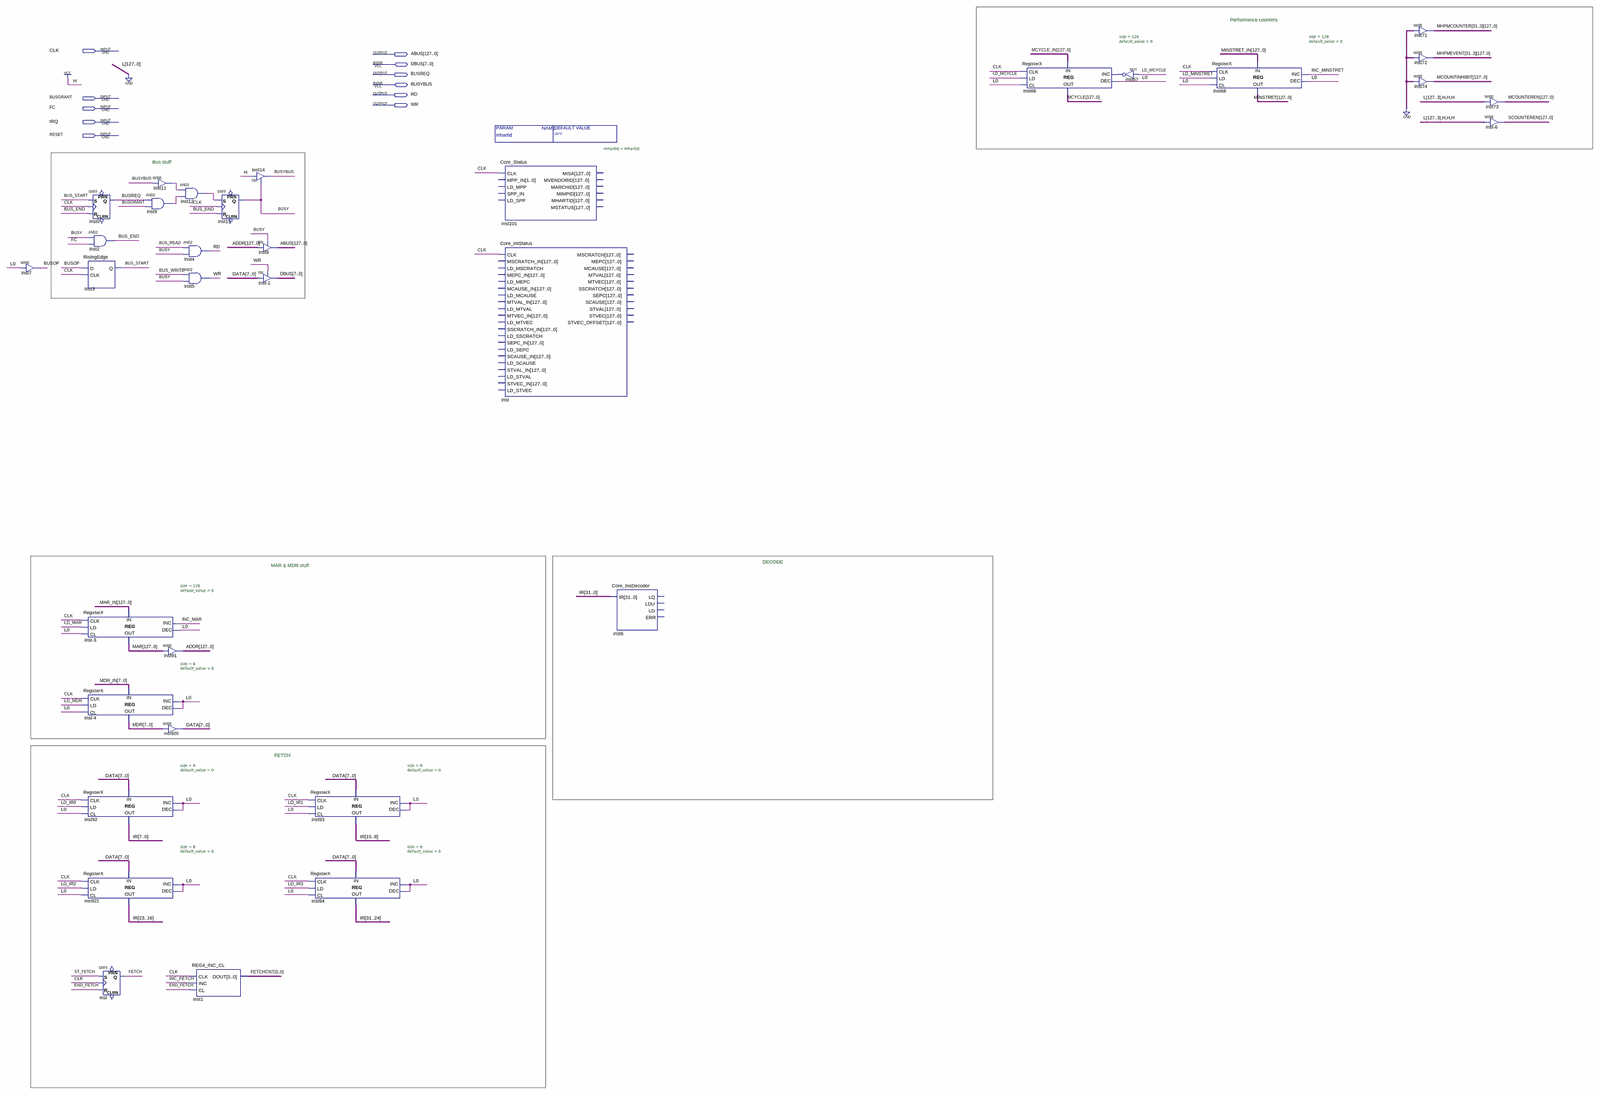
[diagram p0: schematic sheet, whole]
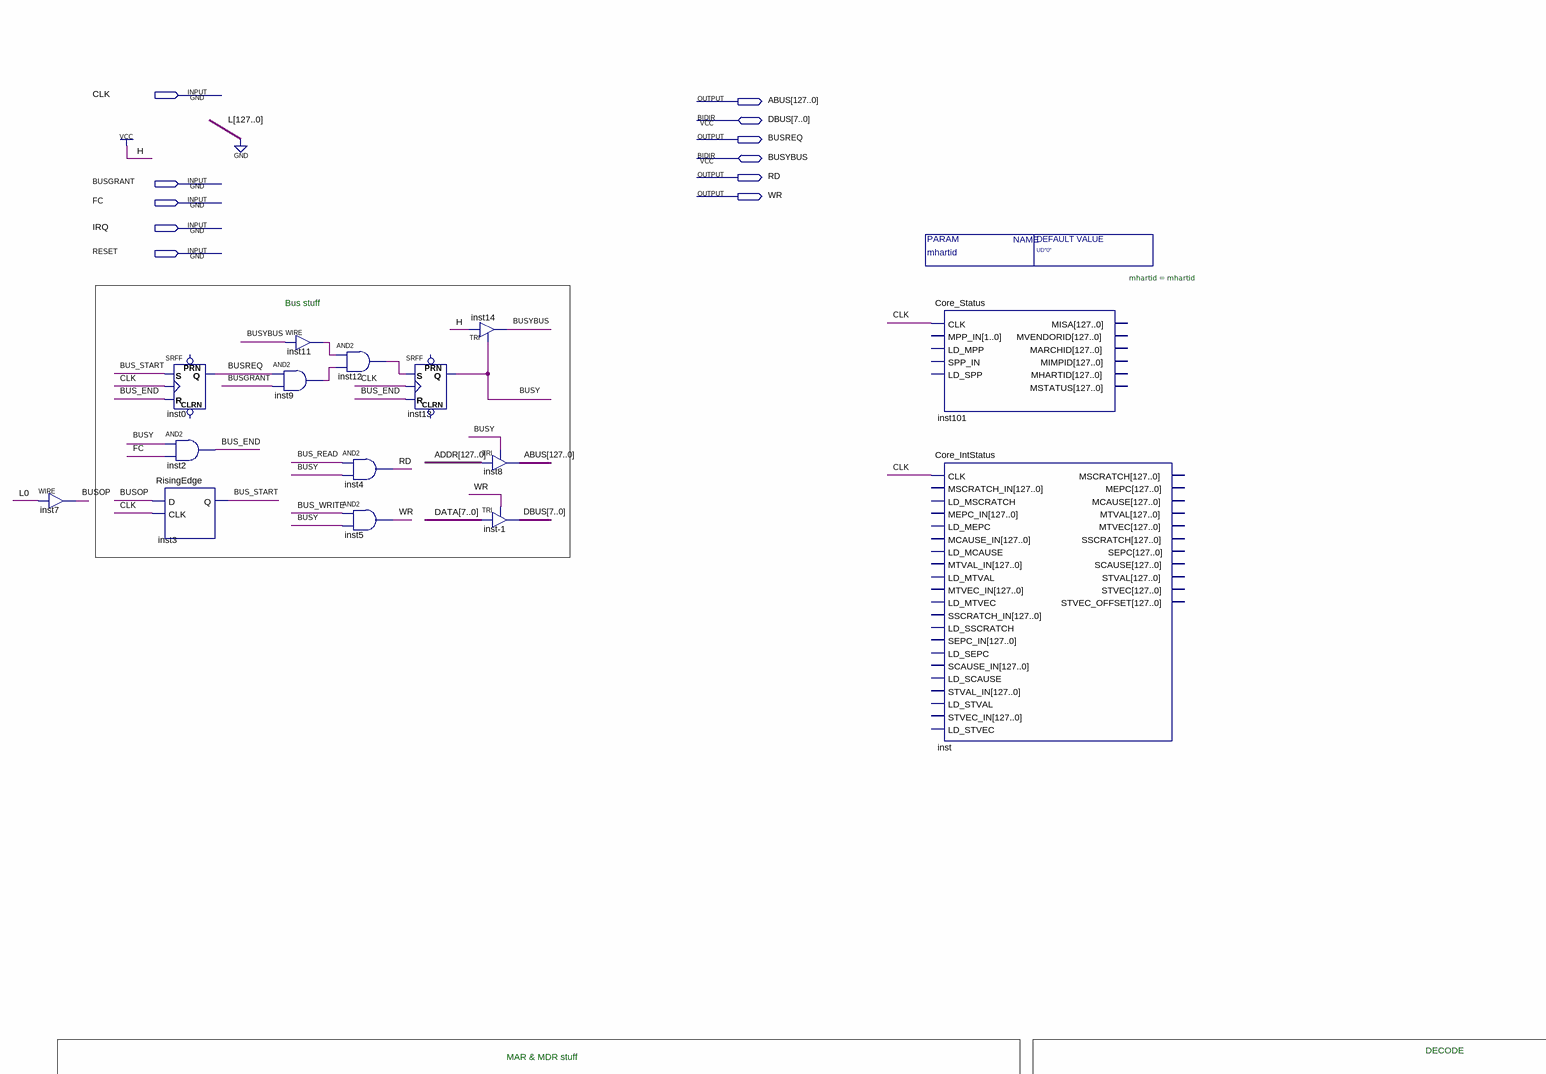
[diagram p1: schematic sheet, upper left part]
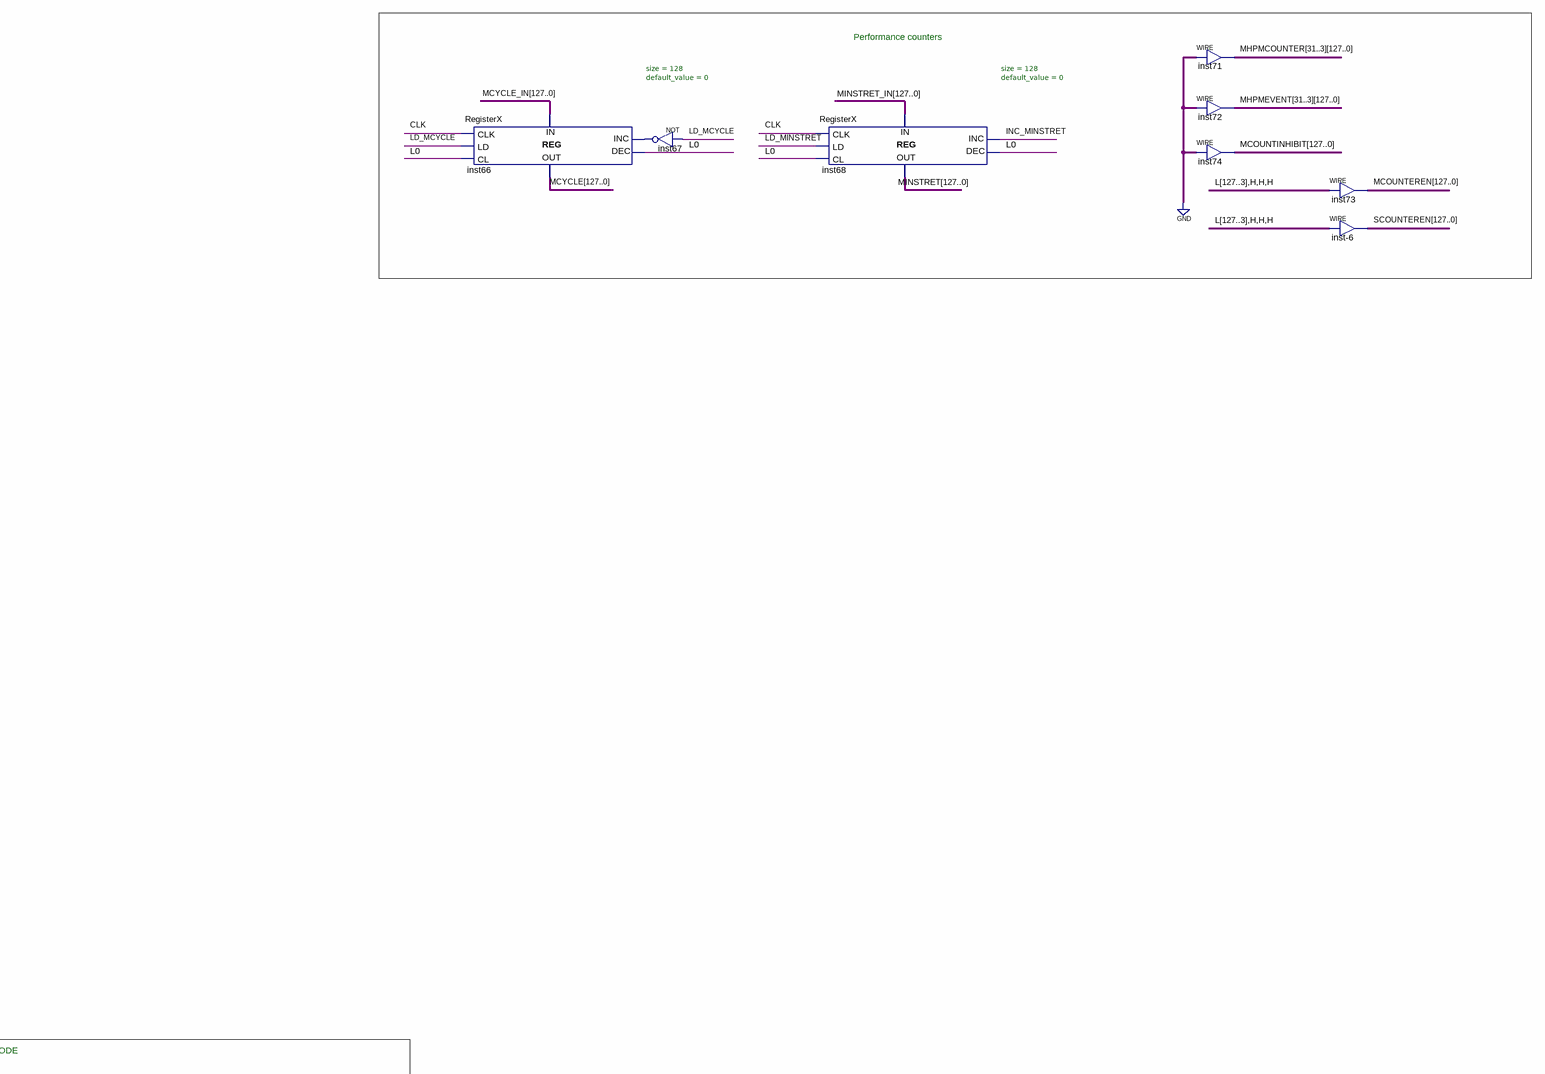
[diagram p2: schematic sheet, upper right part]
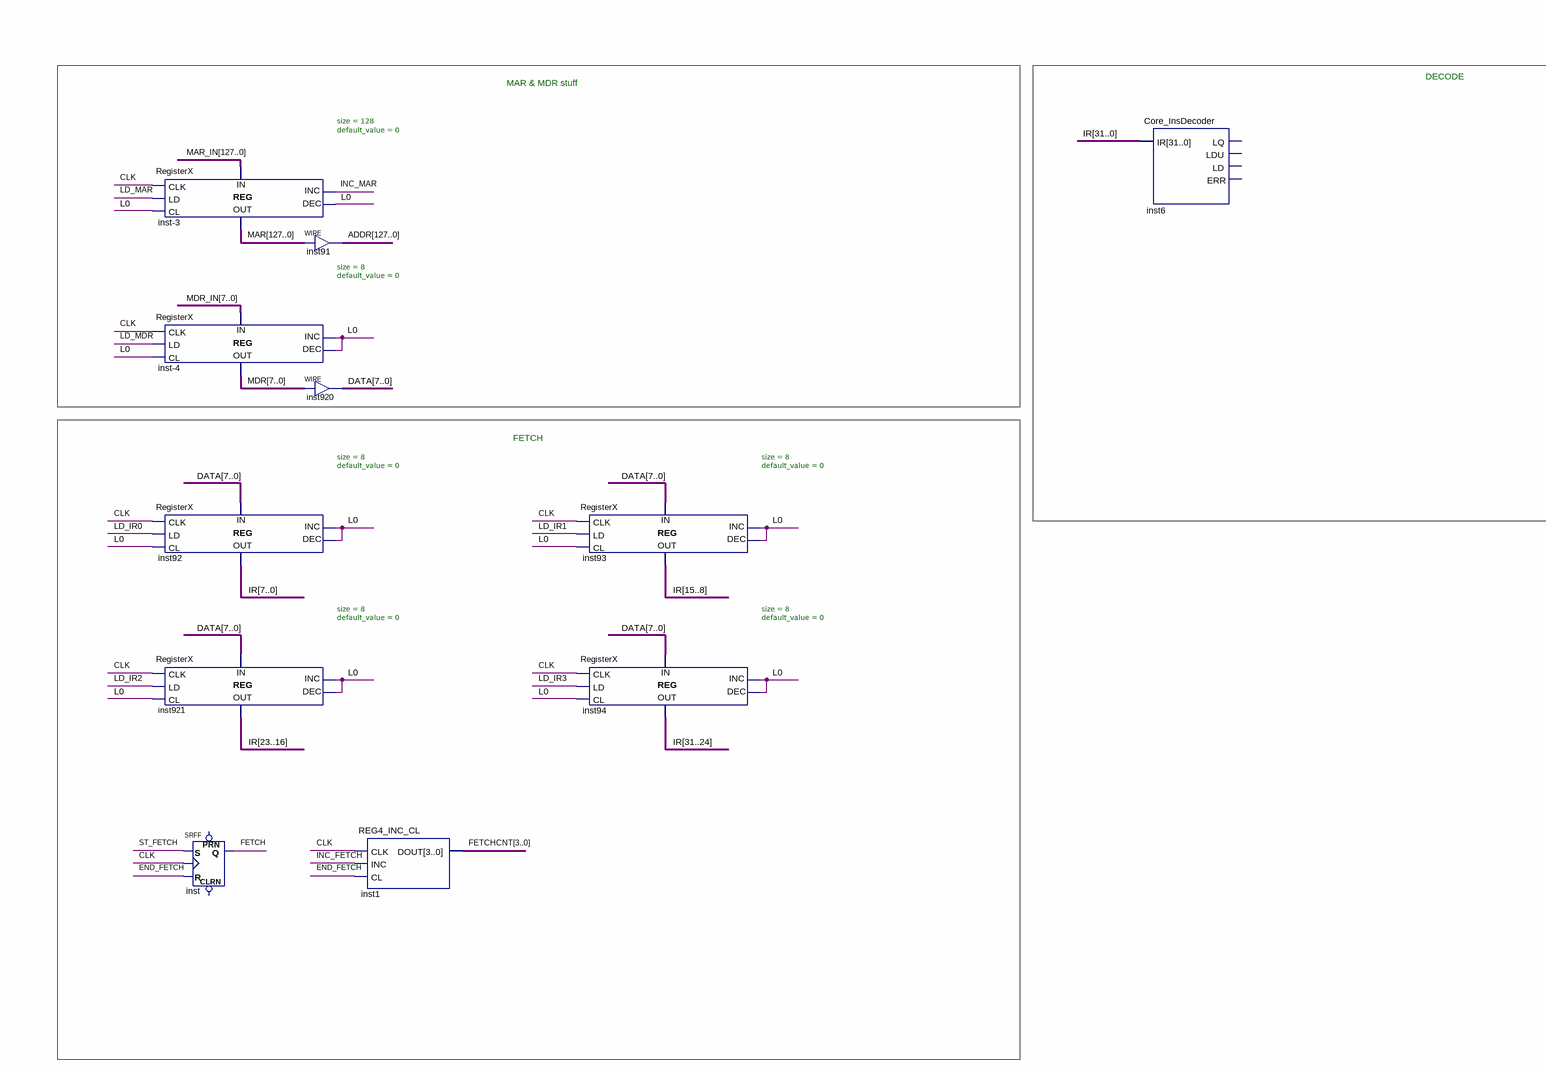
[diagram p3: schematic sheet, lower left part]
// Quartus schematic Core_x128.bdf as structural Verilog: 34 symbols, 11 pins
module Core_x128 #(parameter mhartid = "UD\"0\"") (
  input  CLK,
  input  BUSGRANT,
  input  FC,
  input  IRQ,
  input  RESET,
  inout  [7:0] DBUS,
  inout  BUSYBUS,
  output [127:0] ABUS,
  output BUSREQ,
  output RD,
  output WR
);

  wire BUS_END, BUS_READ, BUS_START, BUS_WRITE, BUSOP, BUSY, END_FETCH, FETCH, INC_FETCH, INC_MAR,
       INC_MINSTRET, inst9_out, inst11_out, inst12_out, inst67_out, LD_IR0, LD_IR1, LD_IR2, LD_IR3, LD_MAR,
       LD_MCYCLE, LD_MDR, LD_MINSTRET, ST_FETCH;
  wire [3:0] FETCHCNT;
  wire [7:0] DATA, MDR, MDR_IN;
  wire [31:0] IR;
  wire [127:0] ADDR, MAR, MAR_IN, MCOUNTEREN, MCOUNTINHIBIT, MCYCLE, MCYCLE_IN, MHPMCOUNTER_3, MHPMCOUNTER_4,
       MHPMCOUNTER_5, MHPMCOUNTER_6, MHPMCOUNTER_7, MHPMCOUNTER_8, MHPMCOUNTER_9, MHPMCOUNTER_10,
       MHPMCOUNTER_11, MHPMCOUNTER_12, MHPMCOUNTER_13, MHPMCOUNTER_14, MHPMCOUNTER_15, MHPMCOUNTER_16,
       MHPMCOUNTER_17, MHPMCOUNTER_18, MHPMCOUNTER_19, MHPMCOUNTER_20, MHPMCOUNTER_21, MHPMCOUNTER_22,
       MHPMCOUNTER_23, MHPMCOUNTER_24, MHPMCOUNTER_25, MHPMCOUNTER_26, MHPMCOUNTER_27, MHPMCOUNTER_28,
       MHPMCOUNTER_29, MHPMCOUNTER_30, MHPMCOUNTER_31, MHPMEVENT_3, MHPMEVENT_4, MHPMEVENT_5, MHPMEVENT_6,
       MHPMEVENT_7, MHPMEVENT_8, MHPMEVENT_9, MHPMEVENT_10, MHPMEVENT_11, MHPMEVENT_12, MHPMEVENT_13,
       MHPMEVENT_14, MHPMEVENT_15, MHPMEVENT_16, MHPMEVENT_17, MHPMEVENT_18, MHPMEVENT_19, MHPMEVENT_20,
       MHPMEVENT_21, MHPMEVENT_22, MHPMEVENT_23, MHPMEVENT_24, MHPMEVENT_25, MHPMEVENT_26, MHPMEVENT_27,
       MHPMEVENT_28, MHPMEVENT_29, MHPMEVENT_30, MHPMEVENT_31, MINSTRET, MINSTRET_IN, SCOUNTEREN;

  assign BUSOP = 1'b0;  // WIRE inst7
  SRFF inst0 (.S(BUS_START), .R(BUS_END), .CLK(CLK), .Q(BUSREQ));  // open: PRN, CLRN
  and inst2 (BUS_END, BUSY, FC);
  RisingEdge inst3 (.D(BUSOP), .CLK(CLK), .Q(BUS_START));
  RegisterX #(.size(128), .default_value(0)) \inst-3  (
    .CLK(CLK), .LD(LD_MAR), .CL(1'b0), .INC(INC_MAR), .DEC(1'b0), .DATA_IN(MAR_IN), .DATA_OUT(MAR));
  RegisterX #(.size(8), .default_value(0)) \inst-4  (
    .CLK(CLK), .LD(LD_MDR), .CL(1'b0), .INC(1'b0), .DEC(1'b0), .DATA_IN(MDR_IN), .DATA_OUT(MDR));
  RegisterX #(.size(8), .default_value(0)) inst92 (
    .CLK(CLK), .LD(LD_IR0), .CL(1'b0), .INC(1'b0), .DEC(1'b0), .DATA_IN(DATA), .DATA_OUT(IR[7:0]));
  RegisterX #(.size(8), .default_value(0)) inst921 (
    .CLK(CLK), .LD(LD_IR2), .CL(1'b0), .INC(1'b0), .DEC(1'b0), .DATA_IN(DATA), .DATA_OUT(IR[23:16]));
  SRFF inst (.S(ST_FETCH), .R(END_FETCH), .CLK(CLK), .Q(FETCH));  // open: PRN, CLRN
  assign inst11_out = BUSYBUS;  // WIRE inst11
  and inst9 (inst9_out, BUSREQ, BUSGRANT);
  and inst12 (inst12_out, inst11_out, inst9_out);
  and inst4 (RD, BUS_READ, BUSY);
  and inst5 (WR, BUS_WRITE, BUSY);
  assign ADDR = MAR;  // WIRE inst91
  assign DATA = MDR;  // WIRE inst920
  REG4_INC_CL inst1 (.CLK(CLK), .INC(INC_FETCH), .CL(END_FETCH), .DOUT(FETCHCNT));
  SRFF inst13 (.S(inst12_out), .R(BUS_END), .CLK(CLK), .Q(BUSY));  // open: PRN, CLRN
  TRI inst14 (.IN(1'b1), .OE(BUSY), .OUT(BUSYBUS));
  TRI inst8[127:0] (.IN(ADDR), .OE(BUSY), .OUT(ABUS));
  TRI \inst-1 [7:0] (.IN(DATA), .OE(WR), .OUT(DBUS));
  RegisterX #(.size(8), .default_value(0)) inst93 (
    .CLK(CLK), .LD(LD_IR1), .CL(1'b0), .INC(1'b0), .DEC(1'b0), .DATA_IN(DATA), .DATA_OUT(IR[15:8]));
  RegisterX #(.size(8), .default_value(0)) inst94 (
    .CLK(CLK), .LD(LD_IR3), .CL(1'b0), .INC(1'b0), .DEC(1'b0), .DATA_IN(DATA), .DATA_OUT(IR[31:24]));
  Core_Status #(.mhartid(mhartid)) inst101 (.CLK(CLK));  // open: MPP_IN, LD_MPP, SPP_IN, LD_SPP, MISA, MVENDORID, MARCHID, MIMPID, MHARTID, MSTATUS
  Core_IntStatus inst_dup2 (.CLK(CLK));  // open: MSCRATCH_IN, LD_MSCRATCH, MEPC_IN, LD_MEPC, MCAUSE_IN, LD_MCAUSE, MTVAL_IN, LD_MTVAL, MTVEC_IN, LD_MTVEC, SSCRATCH_IN, LD_SSCRATCH, SEPC_IN, LD_SEPC, SCAUSE_IN, LD_SCAUSE, STVAL_IN, LD_STVAL, STVEC_IN, LD_STVEC, MSCRATCH, MEPC, MCAUSE, MTVAL, MTVEC, SSCRATCH, SEPC, SCAUSE, STVAL, STVEC, STVEC_OFFSET
  Core_InsDecoder inst6 (.IR(IR));  // open: LQ, LDU, LD, ERR
  RegisterX #(.size(128), .default_value(0)) inst66 (
    .CLK(CLK), .LD(LD_MCYCLE), .CL(1'b0), .INC(inst67_out), .DEC(1'b0), .DATA_IN(MCYCLE_IN), .DATA_OUT(MCYCLE));
  not inst67 (inst67_out, LD_MCYCLE);
  RegisterX #(.size(128), .default_value(0)) inst68 (
    .CLK(CLK), .LD(LD_MINSTRET), .CL(1'b0), .INC(INC_MINSTRET), .DEC(1'b0), .DATA_IN(MINSTRET_IN),
    .DATA_OUT(MINSTRET));
  assign {MHPMCOUNTER_31, MHPMCOUNTER_30, MHPMCOUNTER_29, MHPMCOUNTER_28, MHPMCOUNTER_27, MHPMCOUNTER_26, MHPMCOUNTER_25, MHPMCOUNTER_24, MHPMCOUNTER_23, MHPMCOUNTER_22, MHPMCOUNTER_21, MHPMCOUNTER_20, MHPMCOUNTER_19, MHPMCOUNTER_18, MHPMCOUNTER_17, MHPMCOUNTER_16, MHPMCOUNTER_15, MHPMCOUNTER_14, MHPMCOUNTER_13, MHPMCOUNTER_12, MHPMCOUNTER_11, MHPMCOUNTER_10, MHPMCOUNTER_9, MHPMCOUNTER_8, MHPMCOUNTER_7, MHPMCOUNTER_6, MHPMCOUNTER_5, MHPMCOUNTER_4, MHPMCOUNTER_3} = {3712{1'b0}};  // WIRE inst71
  assign {MHPMEVENT_31, MHPMEVENT_30, MHPMEVENT_29, MHPMEVENT_28, MHPMEVENT_27, MHPMEVENT_26, MHPMEVENT_25, MHPMEVENT_24, MHPMEVENT_23, MHPMEVENT_22, MHPMEVENT_21, MHPMEVENT_20, MHPMEVENT_19, MHPMEVENT_18, MHPMEVENT_17, MHPMEVENT_16, MHPMEVENT_15, MHPMEVENT_14, MHPMEVENT_13, MHPMEVENT_12, MHPMEVENT_11, MHPMEVENT_10, MHPMEVENT_9, MHPMEVENT_8, MHPMEVENT_7, MHPMEVENT_6, MHPMEVENT_5, MHPMEVENT_4, MHPMEVENT_3} = {3712{1'b0}};  // WIRE inst72
  assign MCOUNTINHIBIT = {3712{1'b0}};  // WIRE inst74
  assign MCOUNTEREN = 128'b00000000000000000000000000000000000000000000000000000000000000000000000000000000000000000000000000000000000000000000000000000111;  // WIRE inst73
  assign SCOUNTEREN = 128'b00000000000000000000000000000000000000000000000000000000000000000000000000000000000000000000000000000000000000000000000000000111;  // WIRE inst-6

  // Notes on the sheet:
  //   Performance counters
  //   Bus stuff
  //   DECODE
  //   MAR & MDR stuff
  //   FETCH
endmodule
